# EAGLE design M0_Express_ekho_shield (EAGLE 9.1.3)
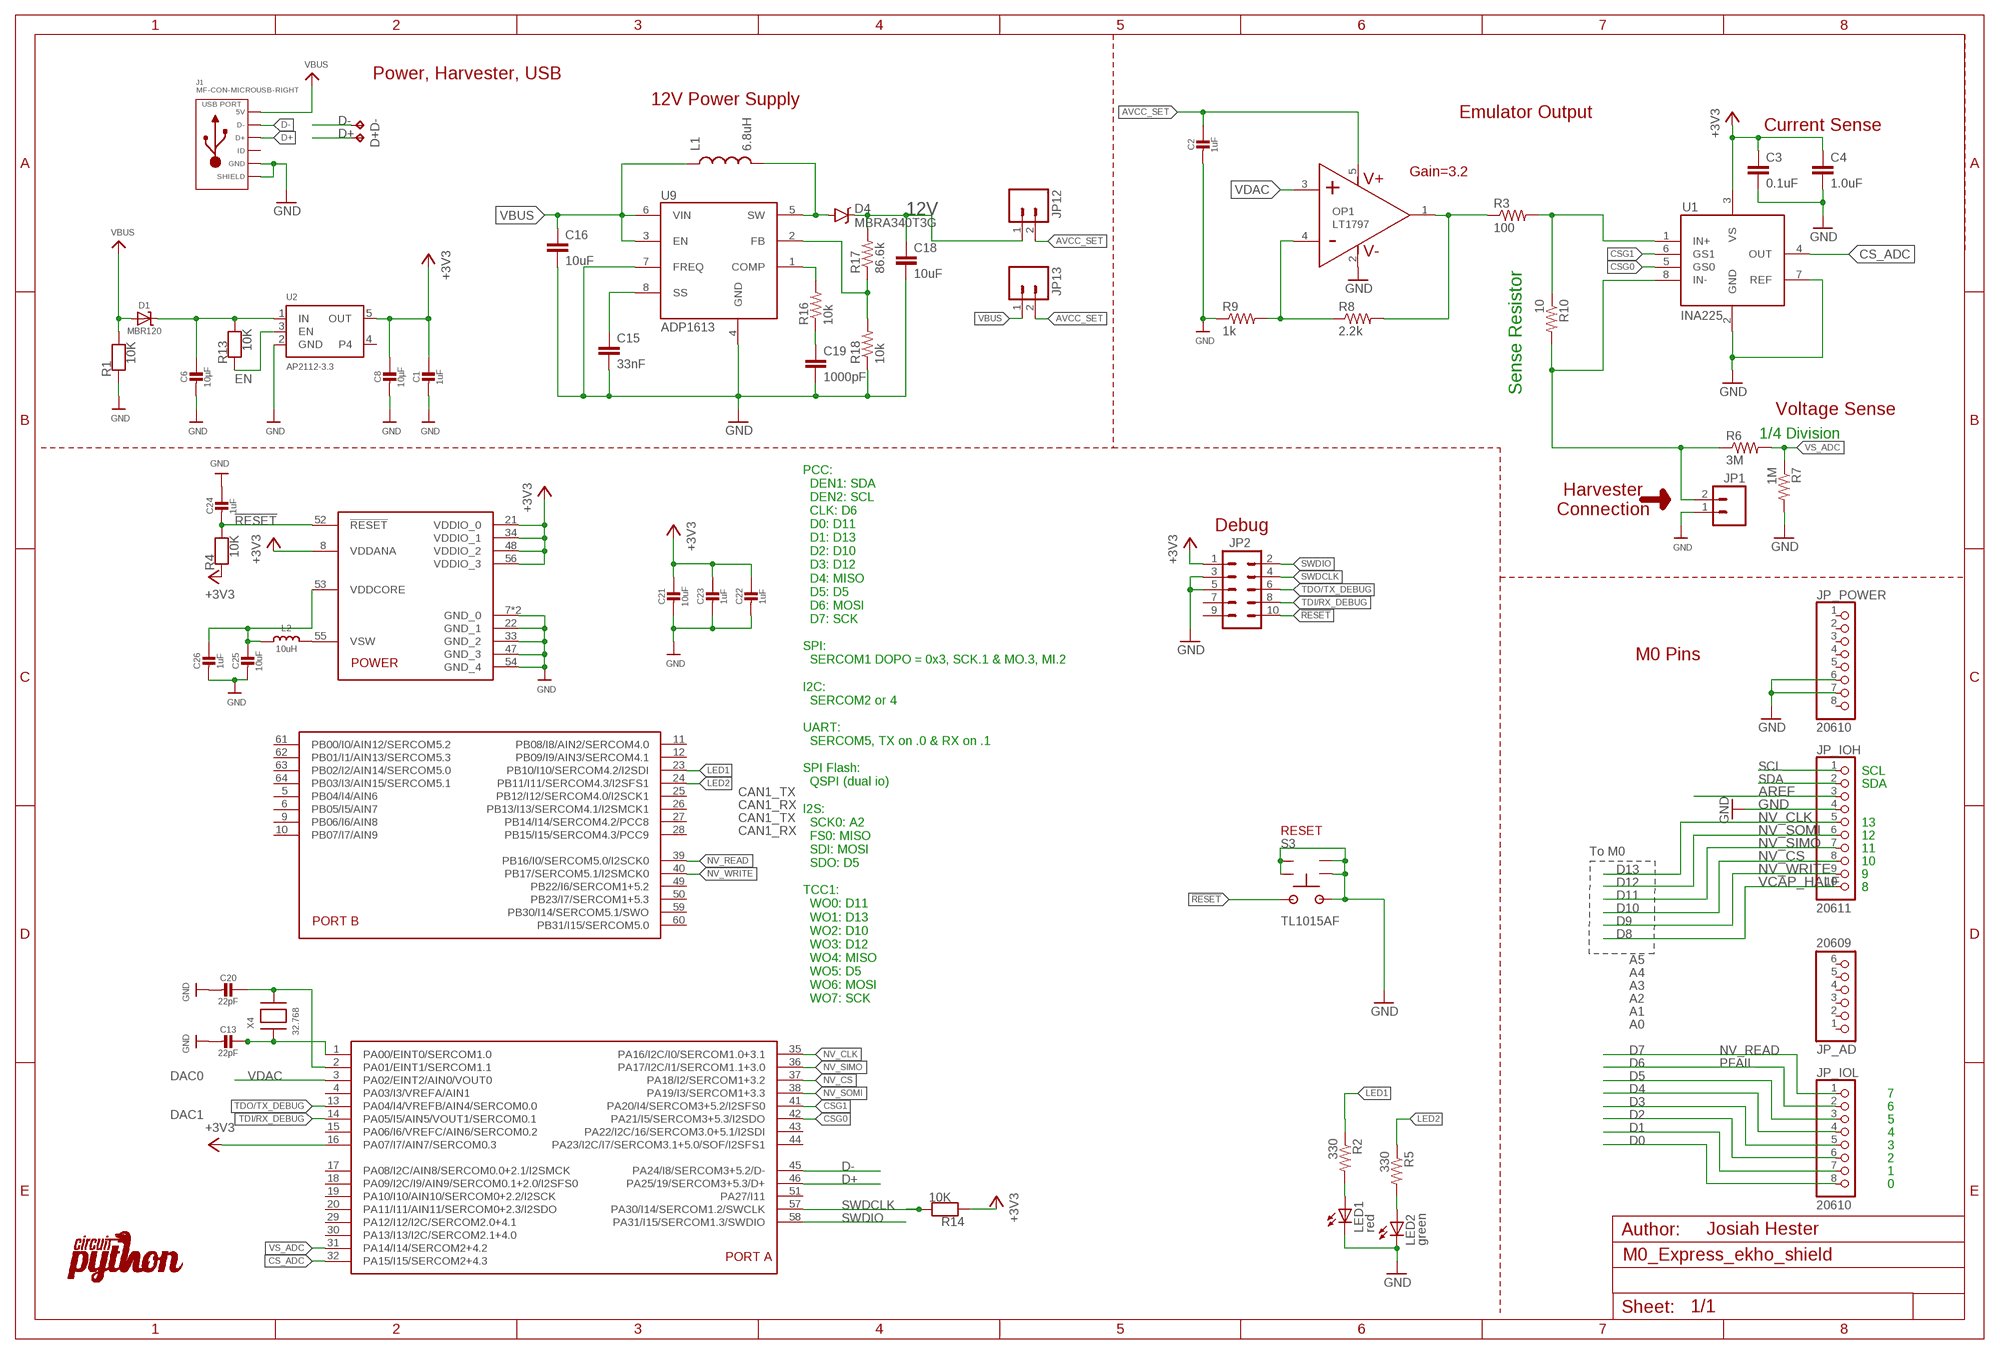
[diagram p0: schematic, sheet 1]

## Parts
C1  1uF  CAP_CERAMIC0603_NO  [0603-NO]
C2  1uF  CAP_CERAMIC0603_NO  [0603-NO]
C3  0.1uF  C-EU0603  [0603]
C4  1.0uF  C-EU0603  [0603]
C6  10µF  CAP_CERAMIC0805-NOOUTLINE  [0805-NO]
C8  10µF  CAP_CERAMIC0805-NOOUTLINE  [0805-NO]
C13  22pF  CAP_CERAMIC0603_NO  [0603-NO]
C15  33nF  CAP0805  [0805]
C16  10uF  CAP0805  [0805]
C18  10uF  CAP1206  [1206]
C19  1000pF  CAP0805  [0805]
C20  22pF  CAP_CERAMIC0603_NO  [0603-NO]
C21  10uF  CAP_CERAMIC0805-NOOUTLINE  [0805-NO]
C22  1uF  CAP_CERAMIC0603_NO  [0603-NO]
C23  1uF  CAP_CERAMIC0603_NO  [0603-NO]
C24  1uF  CAP_CERAMIC0603_NO  [0603-NO]
C25  10uF  CAP_CERAMIC0805-NOOUTLINE  [0805-NO]
C26  1uF  CAP_CERAMIC0603_NO  [0603-NO]
D1  MBR120  DIODE-SCHOTTKYSOD-123  [SOD-123]
D4  MBRA340T3G  [SMA]
D+  TPB1,27  [B1,27]
D-  TPB1,27  [B1,27]
J1  MF-CON-MICROUSB-RIGHT  USB_MICRO_RIGHT  [MICROUSB-RIGHT]
JP1  M02LOCK  [1X02_LOCK]
JP2  M05X21.27MM  [2X5_1.27MM]
JP12  M02LOCK  [1X02_LOCK]
JP13  M02LOCK  [1X02_LOCK]
JP_AD  20609  HEADER-1X6OVALWAVE  [1X06_OVALWAVE]
JP_IOH  20611  HEADER-1X10OVALWAVE  [1X10_OVALWAVE]
JP_IOL  20610  HEADER-1X8OVALWAVE  [1X08_OVALWAVE]
JP_POWER  20610  HEADER-1X8OVALWAVE  [1X08_OVALWAVE]
L1  6.8uH  D03316P  [D03316P]
L2  10uH  INDUCTOR  [INDUCTOR_1007]
LED1  red  LED0603  [LED-0603]
LED2  green  LED0603  [LED-0603]
OP1  LT1797  [TSOT23-8]
R1  10K  RESISTOR_0603_NOOUT  [0603-NO]
R2  330  R-EU0603  [0603]
R3  100  RESISTOR0805-RES  [0805]
R4  10K  RESISTOR_0603_NOOUT  [0603-NO]
R5  330  R-EU0603  [0603]
R6  3M  R-EU0603  [0603]
R7  1M  R-EU0603  [0603]
R8  2.2k  R-EU0603  [0603]
R9  1k  R-EU0603  [0603]
R10  10  RESISTOR0805-RES  [0805]
R13  10K  RESISTOR_0603_NOOUT  [0603-NO]
R14  10K  RESISTOR_0603_NOOUT  [0603-NO]
R16  10k  RESISTOR0805-RES  [0805]
R17  86.6k  R-EU0603  [0603]
R18  10k  R-EU0603  [0603]
S3  TL1015AF  [TS1015]
U1  INA225  [MSOP8]
U2  AP2112-3.3  VREG_SOT23-5  [SOT23-5]
U9  ADP1613  [MSOP08]
U$1  LOGO  [CIRCUITPYTHON-LOGO]
U$14  ATSAMD51J  [PQFN64-1]
X4  32.768  XTAL-3.2X1.5  [XTAL3215]

## Nets
12V: C18.1 D4.C JP12.1 R17.2
!RESET: C24.2 JP2.10 R4.2 S3.2 U$14.52(!RESET)
+3V3 [USB]: C1.1 C3.1 C4.1 C8.1 C21.1 C22.1 C23.1 JP2.1 R4.1 R14.1 U1.3(VS) U2.5(OUT) U$14.8(VDDANA) U$14.16(PA07/I7/AIN7/SERCOM0.3) U$14.21(VDDIO_0) U$14.34(VDDIO_1) U$14.48(VDDIO_2) U$14.56(VDDIO_3)
AREF [aref]: JP_IOH.3
AVCC_SET: C2.1 JP12.2 JP13.2 OP1.5(V+)
CS_ADC: U1.4(OUT) U$14.32(PA15/I15/SERCOM2+4.3)
CSG0: U1.5(GS0) U$14.42(PA21/I5/SERCOM3+5.3/I2SDO)
CSG1: U1.6(GS1) U$14.41(PA20/I4/SERCOM3+5.2/I2SFS0)
D0: JP_IOL.8
D1: JP_IOL.7
D2: JP_IOL.6
D3: JP_IOL.5
D4: JP_IOL.4
D5: JP_IOL.3
D+: D+.TP J1.3(D+) U$14.46(PA25/19/SERCOM3+5.3/D+)
D-: D-.TP J1.2(D-) U$14.45(PA24/I8/SERCOM3+5.2/D-)
EN: R13.1 U2.3(EN)
GND [gnd]: C1.2 C2.2 C3.2 C4.2 C6.2 C8.2 C13.2 C15.2 C16.2 C18.2 C19.2 C20.2 C21.2 C22.2 C23.2 C24.1 C25.2 C26.2 J1.5(GND) J1.S1(SLD) J1.S2(SLD) J1.S3(SLD) J1.S4(SLD) J1.S5(SLD) J1.S6(SLD) JP1.1 JP2.3 JP2.5 JP_IOH.4 JP_POWER.6 JP_POWER.7 LED1.C LED2.C OP1.2(V-) R1.1 R7.2 R9.1 R18.1 S3.1 S3.G1(GND) S3.G2(GND) S3.G3(GND) S3.G4(GND) U1.2(GND) U1.7(REF) U2.2(GND) U9.4(GND) U9.7(FREQ) U$14.7(GND_0) U$14.22(GND_1) U$14.33(GND_2) U$14.47(GND_3) U$14.54(GND_4) U$14.EXP(GND_0)
HARVESTER_IN: OP1.1(OUT) R3.1 R8.2
HIGH_LOAD_V+: R3.2 R10.1 U1.1(IN+)
LED1: R2.1 U$14.23(PB10/I10/SERCOM4.2/I2SDI)
LED2: R5.1 U$14.24(PB11/I11/SERCOM4.3/I2SFS1)
LOW_LOAD_V+: JP1.2 R6.1 R10.2 U1.8(IN-)
N$5: OP1.4(IN-) R8.1 R9.2
N$7: C13.1 U$14.1(PA00/EINT0/SERCOM1.0) X4.P$1
N$8: C20.1 U$14.2(PA01/EINT1/SERCOM1.1) X4.P$2
N$9: C15.1 U9.8(SS)
N$10: L2.P$2 U$14.55(VSW)
N$11: R16.2 U9.1(COMP)
N$12: C19.1 R16.1
N$13: R17.1 R18.2 U9.2(FB)
N$14: LED1.A R2.2
N$15: LED2.A R5.2
NV_CLK: JP_IOH.5 U$14.35(PA16/I2C/I0/SERCOM1.0+3.1)
NV_CS: JP_IOH.8 U$14.37(PA18/I2/SERCOM1+3.2)
NV_READ: JP_IOL.1 U$14.39(PB16/I0/SERCOM5.0/I2SCK0)
NV_SIMO: JP_IOH.7 U$14.36(PA17/I2C/I1/SERCOM1.1+3.0)
NV_SOMI: JP_IOH.6 U$14.38(PA19/I3/SERCOM1+3.3)
NV_WRITE: JP_IOH.9 U$14.40(PB17/SERCOM5.1/I2SMCK0)
PFAIL: JP_IOL.2
SCL: JP_IOH.1
SDA: JP_IOH.2
SW: D4.A L1.P$2 U9.5(SW)
SWDCLK: JP2.4 R14.2 U$14.57(PA30/I14/SERCOM1.2/SWCLK)
SWDIO: JP2.2 U$14.58(PA31/I15/SERCOM1.3/SWDIO)
TDI/RX_DEBUG: JP2.8 U$14.14(PA05/I5/AIN5/VOUT1/SERCOM0.1)
TDO/TX_DEBUG: JP2.6 U$14.13(PA04/I4/VREFB/AIN4/SERCOM0.0)
VBUS [USB]: C16.1 D1.A J1.1(5V) JP13.1 L1.P$1 R1.2 U9.3(EN) U9.6(VIN)
VCAP_HALF: JP_IOH.10
VDAC: OP1.3(IN+) U$14.3(PA02/EINT2/AIN0/VOUT0)
VDDCORE1: C25.1 C26.1 L2.P$1 U$14.53(VDDCORE)
VHI: C6.1 D1.C R13.2 U2.1(IN)
VS_ADC: R6.2 R7.1 U$14.31(PA14/I14/SERCOM2+4.2)
Unconnected: J1.4(ID) JP2.7 JP2.9 JP_AD.1 JP_AD.2 JP_AD.3 JP_AD.4 JP_AD.5 JP_AD.6 JP_POWER.1 JP_POWER.2 JP_POWER.3 JP_POWER.4 JP_POWER.5 JP_POWER.8 U2.4 U$14.4(PA03/I3/VREFA/AIN1) U$14.5(PB04/I4/AIN6) U$14.6(PB05/I5/AIN7) U$14.9(PB06/I6/AIN8) U$14.10(PB07/I7/AIN9) U$14.11(PB08/I8/AIN2/SERCOM4.0) U$14.12(PB09/I9/AIN3/SERCOM4.1) U$14.15(PA06/I6/VREFC/AIN6/SERCOM0.2) U$14.17(PA08/I2C/AIN8/SERCOM0.0+2.1/I2SMCK) U$14.18(PA09/I2C/I9/AIN9/SERCOM0.1+2.0/I2SFS0) U$14.19(PA10/I10/AIN10/SERCOM0+2.2/I2SCK) U$14.20(PA11/I11/AIN11/SERCOM0+2.3/I2SDO) U$14.25(PB12/I12/SERCOM4.0/I2SCK1) U$14.26(PB13/I13/SERCOM4.1/I2SMCK1) U$14.27(PB14/I14/SERCOM4.2/PCC8) U$14.28(PB15/I15/SERCOM4.3/PCC9) U$14.29(PA12/I12/I2C/SERCOM2.0+4.1) U$14.30(PA13/I13/I2C/SERCOM2.1+4.0) U$14.43(PA22/I2C/16/SERCOM3.0+5.1/I2SDI) U$14.44(PA23/I2C/I7/SERCOM3.1+5.0/SOF/I2SFS1) U$14.49(PB22/I6/SERCOM1+5.2) U$14.50(PB23/I7/SERCOM1+5.3) U$14.51(PA27/I11) U$14.59(PB30/I14/SERCOM5.1/SWO) U$14.60(PB31/I15/SERCOM5.0) U$14.61(PB00/I0/AIN12/SERCOM5.2) U$14.62(PB01/I1/AIN13/SERCOM5.3) U$14.63(PB02/I2/AIN14/SERCOM5.0) U$14.64(PB03/I3/AIN15/SERCOM5.1)

## Notes on the sheet
- Power, Harvester, USB
- 12V Power Supply
- Emulator Output
- Current Sense
- Gain=3.2
- Sense Resistor
- Voltage Sense
- 1/4 Division
- Harvester
  Connection
- Debug
- M0 Pins
- SCL
- SDA
- CAN1_TX
- CAN1_RX
- CAN1_TX | 13
- CAN1_RX | RESET | 12
- 11
- To M0
- 10
- D13 | 9
- D12 | 8
- D11
- D10
- D9
- D8
- A5
- A4
- A3
- PCC:
    DEN1: SDA
    DEN2: SCL
    CLK: D6
    D0: D11
    D1: D13
    D2: D10
    D3: D12
    D4: MISO
    D5: D5
    D6: MOSI
    D7: SCK
  
  SPI:
    SERCOM1 DOPO = 0x3, SCK.1 & MO.3, MI.2
  
  I2C:
    SERCOM2 or 4
  
  UART:
    SERCOM5, TX on .0 & RX on .1
  
  SPI Flash:
    QSPI (dual io)
  
  I2S:
    SCK0: A2
    FS0: MISO
    SDI: MOSI
    SDO: D5
  
  TCC1:
    WO0: D11
    WO1: D13
    WO2: D10
    WO3: D12
    WO4: MISO
    WO5: D5
    WO6: MOSI
    WO7: SCK
- A2
- A1
- A0
- D7
- D6
- DAC0
- 7
- 6
- DAC1 | 5
- 4
- 3
- 2
- 1
- 0
- Josiah Hester

## Library data of the parts
C1 C2 C6 C8 C13 C20-C26 = microbuilder:CAP_CERAMIC: Ceramic Capacitors For new designs, use the packages preceded by an '_' character since they are more reliable: The following footprints should be used on most boards: _0402 - Standard footprint for regular board layouts _0603 - Standard footprint for regular board layouts _0805 - Standard footprint for regular board layouts _1206 - Standard footprint for regular board layouts For extremely tight-pitch boards where space is at a premium, the following 'micro-pitch' footprints can be used (smaller pads, no silkscreen outline, etc.): _0402MP - Micro-pitch footprint for very dense/compact boards _0603MP - Micro-pitch footprint for very dense/compact boards _0805MP - Micro-pitch footprint for very dense/compact boards _1206MP - Micro-pitch footprint for very dense/compact boards
C3 = tiny_passives:C-EU; DIGIKEY: 490-3271-1-ND
C4 = tiny_passives:C-EU; DIGIKEY: 490-3890-1-ND
C15 = SparkFun-Capacitors:CAP: Capacitor Standard 0603 ceramic capacitor, and 0.1" leaded capacitor.; DIGIKEY: 399-8070-1-ND; MPN: C0805C333J5RACTU
C16 = SparkFun-Capacitors:CAP: Capacitor Standard 0603 ceramic capacitor, and 0.1" leaded capacitor.; DIGIKEY: 587-1295-1-ND; MPN: EMK212BJ106KG-T
C18 = SparkFun-Capacitors:CAP: Capacitor Standard 0603 ceramic capacitor, and 0.1" leaded capacitor.; DIGIKEY: 587-1337-1-ND; MPN: TMK316BJ106KL-T
C19 = SparkFun-Capacitors:CAP: Capacitor Standard 0603 ceramic capacitor, and 0.1" leaded capacitor.; DIGIKEY: 399-1149-1-ND
D1 = microbuilder:DIODE-SCHOTTKY
D4 = MBRA340T3G:MBRA340T3G: Surface Mount Schottky Power Rectifier: 3.0 AMPERES 40 VOLTS, SMA Power Surface Mount Package Employing the Schottky Barrier principle in a large area metal−to−silicon power diode. State of the art geometry features epitaxial construction with oxide passivation and metal overlay contact. Ideally suited for low voltage, high frequency rectification, or as free wheeling and polarity diodes in surface mount applications where compact size and weight are critical to the system.; DIGIKEY: MBRA340T3GOSCT-ND; MPN: MBRA340T3G
D+ D- = testpad:TP: Test pad
J1 = MF_Connectors:USB: Library: MF_Connectors Description: 5 Pin USB Connectors. SLD is the shield connection. Usually tied to ground through a small ferrite bead.; HOUSEPART: YES; MPN: MF-CON-MICROUSB-RIGHT; POPULATE: 1; URL: https://factory.macrofab.com/part/MF-CON-MICROUSB-RIGHT
JP1 JP12 JP13 = SparkFun-Connectors:M02: Standard 2-pin 0.1" header. Use with - straight break away headers ( PRT-00116) - right angle break away headers (PRT-00553) - swiss pins (PRT-00743) - machine pins (PRT-00117) - female headers (PRT-00115) Molex polarized connector foot print use with: PRT-08233 with associated crimp pins and housings. 2.54_SCREWTERM for use with PRT-10571. 3.5mm Screw Terminal footprints for PRT-08084 5mm Screw Terminal footprints for use with PRT-08432
JP2 = SparkFun-Connectors:M05X2: Header 5x2 Standard 10-pin dual row 0.1" header. Commonly used with AVR-ISP. Use with Spark Fun Electronics SKU: PRT-00778; DIGIKEY: 1175-1627-ND; MPN: 3220-10-0100-00
JP_AD = microbuilder:HEADER-1X6: PIN HEADER
JP_IOH = microbuilder:HEADER-1X10: PIN HEADER
JP_IOL JP_POWER = microbuilder:HEADER-1X8: PIN HEADER
L1 = do3316p:D03316P; MPN: DO3316P
L2 = microbuilder:INDUCTOR: Inductors 0603: 10nH Ceramic Inductor - microwire antenna/RF (Digikey: 712-1434-2-ND) 0805: 560nH Ceramic Inductor - RF (Digikey: 553-1047-1-ND) 270nH Ceramic Inductor - Q = 40@250MHz, +-5%, 1 Ohm DC Resistance (Digikey: 535-10506-2-ND) 1007 (2518 Metric) SMT: 10µH 10% 250mOhm 820mA 1007 Inductor (Digikey: 587-2189-1-ND) 22µH 10% 500mOhm 580mA 1007 Inductor (Digikey: 587-2190-1-ND) 47µH 10% 950mOhm 420mA 1007 Inductor (Digikey: 587-2191-1-ND) 47µH 5% 100mOhm 1A 1008 Inductor (Digikey: 732-1816-1-ND) 5.0x5.0mm (Taiyo Yuden NR5040 Series) 6.8µH 20% 2.3A 64mOhm Inductor (Digikey: 587-2374-2-ND) 5.0x5.0mm (TDK VLC5045 Series) 4.7µH 20% 3.3A 34mOhm Inductor (Digikey: 445-6526-1-ND) 6.8µH 20% 2.7A 46mOhm Inductor (Digikey: 445-6527-1-ND) 6.0x6.0mm (TDK VLC6045 Series) 4.7µH 20% 3.8A 27mOhm Inductor (Digikey: 445-6538-2-ND) 6.8µH 20% 3A 41mOhm Inductor (Digikey: 445-6540-1-ND) 6.2µH 30% 2.2A 45mOhm Inductor (Digikey: SRR5028-6R2YCT-ND) - Not TDK VLC6045 but footprint should match 6.0x6.0mm (TDK SLF6045 Series) 6.8uH 30% 2A 33mOhm Inductor (Digikey: 445-4572-1-ND, Mouser: 810-SLF645T6R8N2R0PF) 6.0x6.0mm (Sumida CDRH5D28 Series) 6.2uH 30% 1.8A 45mOhm Inductor (Digikey: 308-1542-1-ND) Taiyo Yuden NR3015T2R2M - 2.2uH 20% 1.5A (Digikey: 587-1648-2-ND, Mouser: 963-NR3015T2R2M) - Used with TI TPS62172 CoilCraft RFID Transponder Coil - MA5532-AE (For use with AS3935 Lightning Sensor) Taiyo Yuden NRH2412T2R2MNGH - 2.2uH 20% 1AA (Digikey: 587-3443-1-ND) - Used with TI LM3671 Vishay IHLP 1.0uH Molded Inductor - 24mOhm DCR, 5A, +/-20%, -55°C-125°C (Digikey: 541-1319-1-ND)
LED1 LED2 = SparkFun-LED:LED: LEDs Standard schematic elements and footprints for 5mm, 3mm, 1206, and 0603 sized LEDs. 5mm - Spark Fun Electronics SKU : COM-00529 (and others)
OP1 = LT1797:LT1797: LT1797: 10MHz, Rail-to-Rail Input and Output Op Amp in SOT-23 The LT®1797 is a unity-gain stable 10MHz op amp available in the small SOT-23 package that operates on all single and split supplies with a total voltage of 2.7V to 12V. The amplifier draws 1mA of quiescent current and has a slew rate of 2.25V/μs. The input common mode range of the LT1797 includes both rails, making it ideal for current sensing applications. The input stage incorporates phase reversal protection to prevent false outputs from occurring when the inputs are driven beyond the supplies. Protective resistors are included in the input leads so that current does not become excessive when the inputs are forced above or below the supplies. The output of the LT1797 can swing to within 50mV of V+ and 8mV of V– without drawing excess current in either condition. The amplifier can drive loads up to 25mA and still maintain rail-to-rail capability.; DIGIKEY: LT1797CS5#TRMPBFTR-ND
R1 R4 R13 R14 = microbuilder:RESISTOR: Resistors For new designs, use the packages preceded by an '_' character since they are more reliable: The following footprints should be used on most boards: _0402 - Standard footprint for regular board layouts _0603 - Standard footprint for regular board layouts _0805 - Standard footprint for regular board layouts _1206 - Standard footprint for regular board layouts For extremely tight-pitch boards where space is at a premium, the following 'micro-pitch' footprints can be used (smaller pads, no silkscreen outline, etc.): _0402MP - Micro-pitch footprint for very dense/compact boards _0603MP - Micro-pitch footprint for very dense/compact boards _0805MP - Micro-pitch footprint for very dense/compact boards _1206MP - Micro-pitch footprint for very dense/compact boards
R2 R5 = tiny_passives:R-EU
R3 R10 = SparkFun-Passives:RESISTOR: Resistor Basic schematic elements and footprints for 0603, 1206, and PTH resistors.
R6 R7 = tiny_passives:R-EU; DIGIKEY: P2.0MJCT-ND
R8 R9 = tiny_passives:R-EU; DIGIKEY: 311-40.2KLRCT-ND
R16 = SparkFun-Passives:RESISTOR: Resistor Basic schematic elements and footprints for 0603, 1206, and PTH resistors.; DIGIKEY: 311-10KARCT-ND; MPN: RC0805JR-0710KL
R17 = tiny_passives:R-EU; DIGIKEY: 311-86.6KCRCT-ND; MPN: RC0805FR-0786K6L
R18 = tiny_passives:R-EU; DIGIKEY: 541-10.0KCCT-ND; MPN: CRCW080510K0FKEA
S3 = eswitch:TL1015AF; MPN: TL1015AF160QG
U1 = ina225:INA225; DIGIKEY: 296-37540-1-ND; MPN: INA225AIDGKT
U2 = microbuilder:VREG_SOT23-5: SOT23-5 Fixed Voltage Regulators Part Current Out V Out V In V Dropout θJA (°C/W) TJ (°C) Digikey Part No. ADP121 150mA 3.3V 3.4-5.5V 0.09V @ 150mA -- -- ADP121-AUJZ33R7CT-ND ADP121 150mA 3.0V 3.1-5.5V 0.09V @ 150mA -- -- ADP121-AUJZ30R7CT-ND ADP122 300mA 3.3V 3.4-5.5V 0.085V @ 300mA -- -- ADP122AUJZ-3.3-R7CT-ND ADP1712 300mA 3.3V 3.5-5.5V 0.17V @ 300mA -- -- ADP1712AUJZ-3.3-R7TR-ND AP7311 (Low Cost) 150mA 3.3V 3.5-6V 0.15V @ 150mA -- -- AP7311-33WG-7DICT-ND LD39015M18R 150mA 1.8V 1.9V-5.5V 0.08V @ 100mA -- -- 497-6977-1-ND LP2985A-33DBVR 150mA 3.3V 3.3-16V 0.28V @ 150mA 206 150 296-18479-1-ND MCP1824T-3302E/OT 300mA 3.3V 3.5V-6V 0.2V @ 300mA -- -- MCP1824T-3302E/OTCT-ND MIC5205-2.5YM5 TR 150mA 2.5V 2.7-16V 0.165V @ 150mA -- -- 576-1257-2-ND MIC5205-3.0YM5 TR 150mA 3.0V 3.2V-16V 0.165V @ 150mA -- -- 576-1258-2-ND MIC5205-3.3YM5 TR 150mA 3.3V 3.5V-16V 0.165V @ 150mA -- -- 576-1259-2-ND TPS780330220 150mA 3.3V+2.2V 3.6-5.5V 250mV Max -- -- 296-23332-1-ND TDA3663/N1,135 100mA 3.3V 3.5-45V 0.18V @ 50mA -- -- 568-5343-1-ND Max operating temp can be calculated using θJA, TJ (max junction temperature), and power in watts. Set the "Maximum Ambient Temperature" until it reaches TJ ("Max Junction Temperature"), which is the absolute limit for safe use of the regulator: Heat Sink Temperature Calculator <http://www.daycounter.com/Calculators/Heat-Sink-Temperature-Calculator.phtml> For example, With 12V source into a 3.3V LP2985 and a 30mA load, we are dissipating (12V-3.3V) * 0.03A = 0.261W. With a θJA of 206 °C/W, a TJ of 150°C, and 261mW we can safely use the chip without a heat sink up to 75°C (=147.1°C Junction Temperature).
U9 = ADP1613:ADP1613: 650 kHz /1.3 MHz Step-Up PWM DC-to-DC Switching Converters The ADP1612/ADP1613 are step-up dc-to-dc switching converters with an integrated power switch capable of providing an output voltage as high as 20 V. With a package height of less than 1.1 mm, the ADP1612/ADP1613 are optimal for spaceconstrained applications such as portable devices or thin film transistor (TFT) liquid crystal displays (LCDs). The ADP1612/ADP1613 operate in current mode pulse-width modulation (PWM) with up to 94% efficiency. Adjustable soft start prevents inrush currents when the part is enabled. The pin-selectable switching frequency and PWM current-mode architecture allow for excellent transient response, easy noise filtering, and the use of small, cost-saving external inductors and capacitors. Other key features include undervoltage lockout (UVLO), thermal shutdown (TSD), and logic controlled enable.; DIGIKEY: ADP1613ARMZ-R7CT-ND; MPN: ADP1613ARMZ-R7
U$1 = circuitpython-logo:LOGO
U$14 = microbuilder:ATSAMD51J: ATSAMD51J cortex m4 microcontroller; DIGIKEY: ATSAMD51J19A-MU-ND; MPN: ATSAMD51J19A-MU
X4 = adafruit2:XTAL: Low cost SMT crystals, no capacitors included http://www.ladyada.net/library/eagle

## Net classes
0 default: width 0.152 mm, drill 0.152 mm, clearance 0.152 mm

## Board
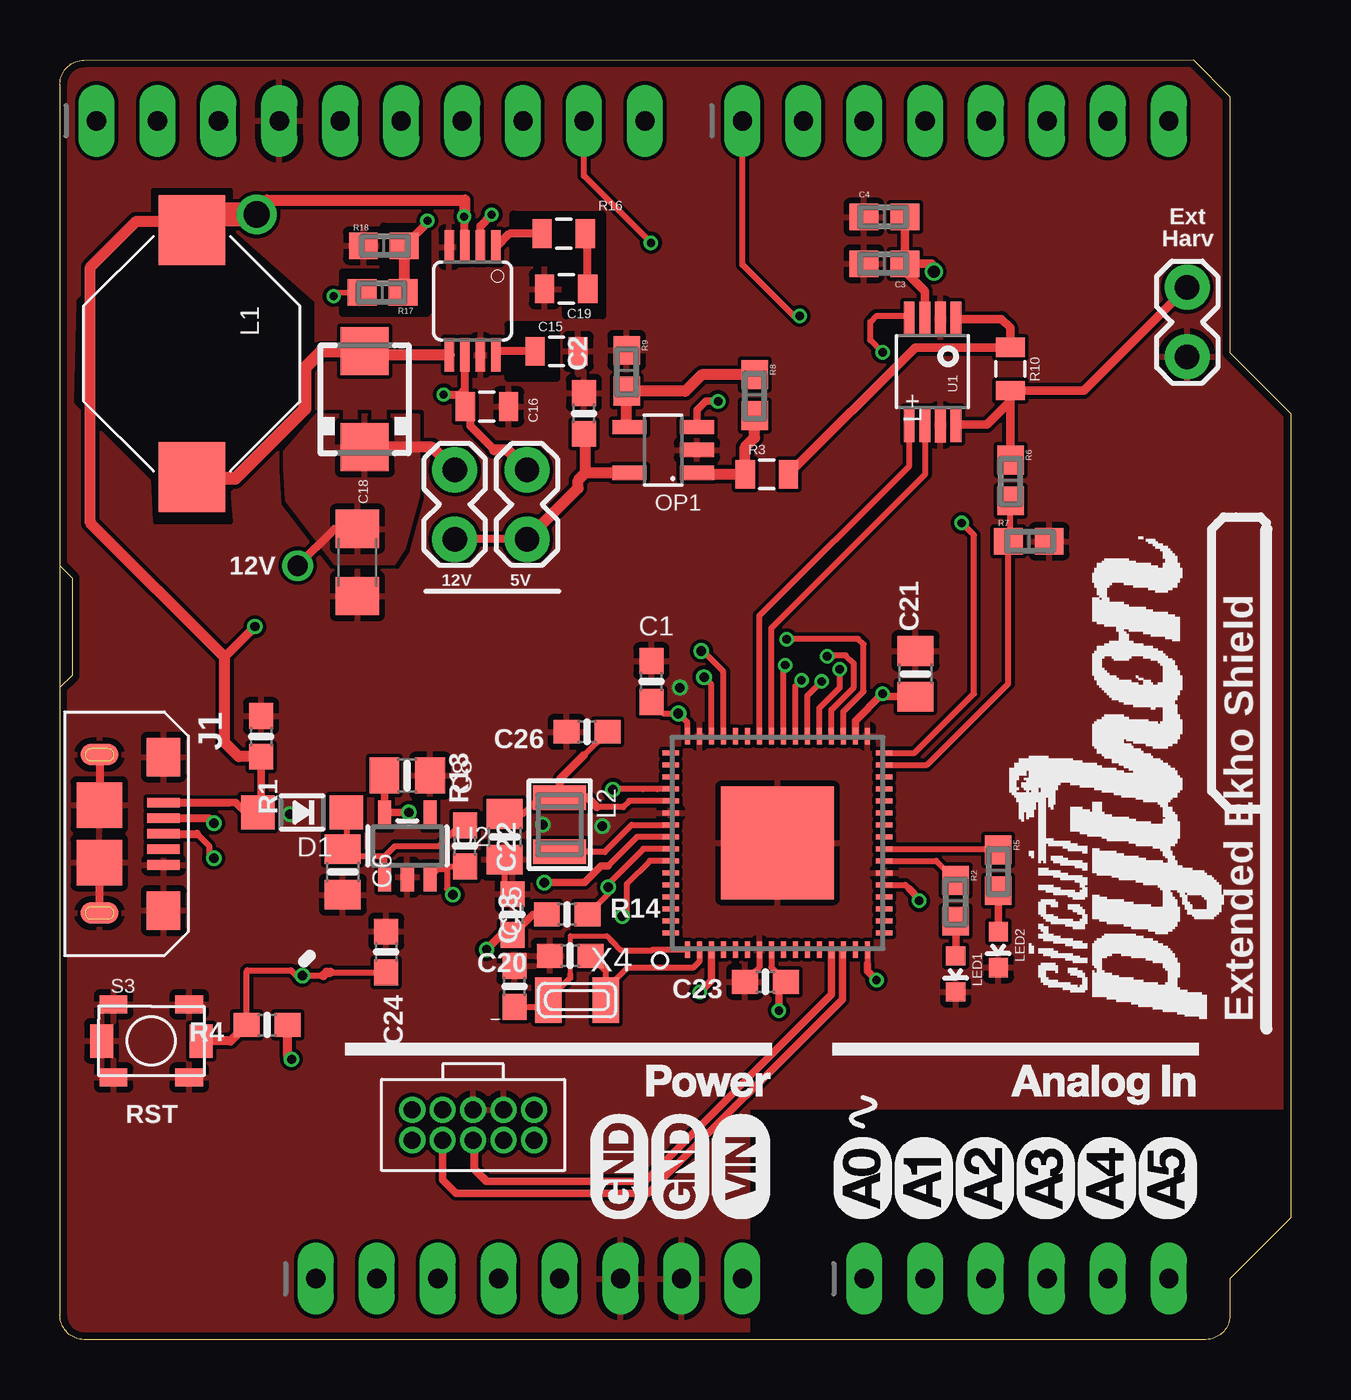
[diagram p1: board, top side]
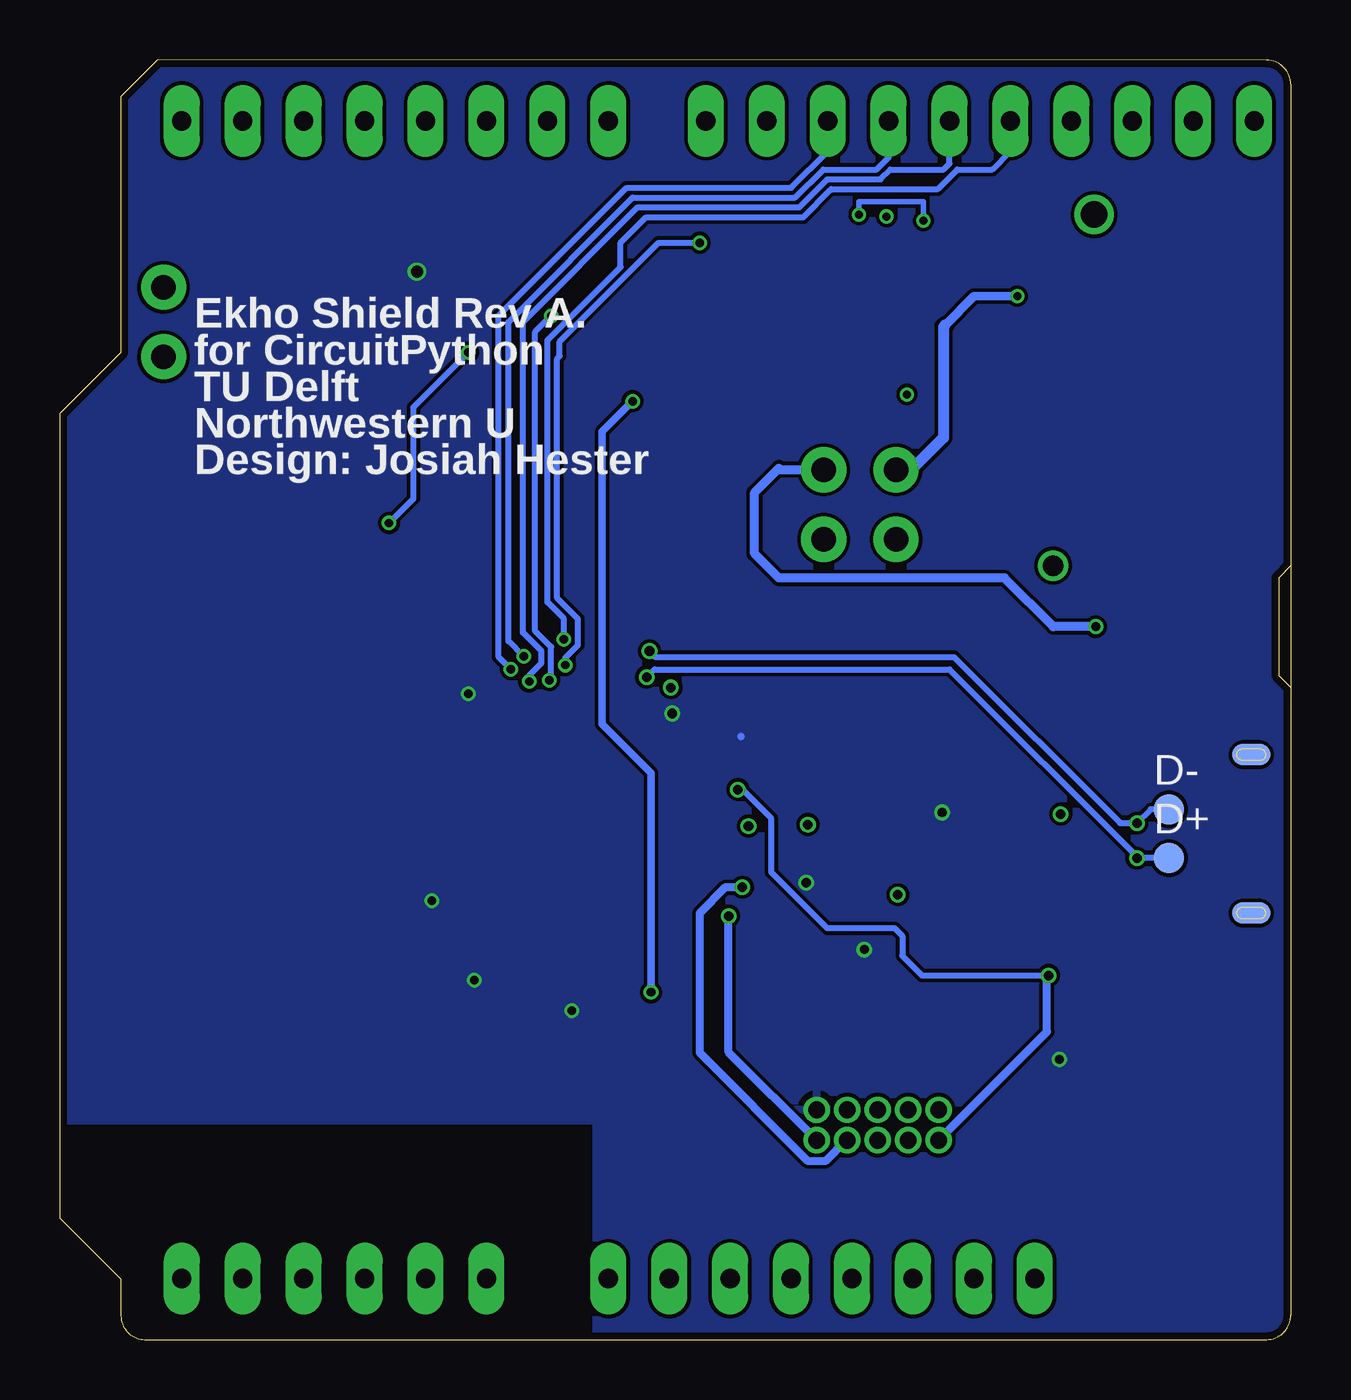
[diagram p2: board, bottom side, seen from below]

Size 51.31 x 53.34 mm. Coordinates in mm from the lower left corner, seen from the top.
Outline: 51.31,13.72 51.31,5.08 48.77,2.54 48.77,1 arc-90 47.77,0 1,0 arc-90 0,1.02 0,52.32 arc-90 1,53.32 47.24,53.34 48.77,51.82 48.77,41.15 51.31,38.61 51.31,24.38 51.31,13.72
Outline: 51.31,13.97 51.31,13.72
Outline: 0,32.26 0.51,31.75 0.51,27.69 0,27.18
Copper layers (1*16): Top 0.035559375mm / dielectric 1.6mm / Bottom 0.035559375mm
Design rules "oshpark-2layer *": minimum track width 6mil, minimum drill 10mil, track to track 6mil, track to pad 6mil, pad to pad 6mil, via to via 6mil, smd to smd 6mil, copper to edge 12mil, drill to drill 6mil, minimum pad ring 5mil, minimum via ring 5mil, stop-mask expansion 2.5mil, vias tented up to drill 0mil, thermal gap 10mil

### Footprints (pad centres in the part's own frame; a part is rotated, then mirrored left to right if it is on the bottom)
0603-NO = smd 1.075 x 1: 1 -0.85,0; 2 0.85,0
0603 = smd 1.2 x 1.1: 1 -0.85,0; 2 0.85,0
0805-NO = smd 1.24 x 1.5: 1 -0.95,0; 2 0.95,0
0805 = smd 0.8 x 1.2: 1 -0.9,0; 2 0.9,0
1206 = smd 1.6 x 1.8: 1 -1.4,0; 2 1.4,0
SOD-123 = smd 1.4 x 1.4: A 1.85,0; C -1.85,0
SMA = smd 2 x 2: A 2,0; C -2,0
B1,27 = smd 1.27 x 1.27: TP 0,0
MICROUSB-RIGHT = smd 0.4 x 1.35: 1 -1.3,1.27; 2 -0.65,1.27; 3 0,1.27; 4 0.65,1.27; 5 1.3,1.27 | smd 0.9 x 1.6: S1 -3.3,-1.4; S2 3.3,-1.4 | smd 1.6 x 1.4: S3 -3.2,1.27; S4 3.2,1.27 | smd 1.9 x 1.9: S5 -1.2,-1.405; S6 1.2,-1.405 | smd 0.9 x 1.6 bottom: S7 -3.3,-1.4; S8 3.3,-1.4
1X02_LOCK = drill 1.016 pad 1.88: 1 -0.178,0; 2 2.718,0
2X5_1.27MM = drill 0.7 pad 1.1: 1 0,0; 2 1.27,0; 3 0,-1.27; 4 1.27,-1.27; 5 0,-2.54; 6 1.27,-2.54; 7 0,-3.81; 8 1.27,-3.81; 9 0,-5.08; 10 1.27,-5.08
1X06_OVALWAVE = drill 0.8 pad 1.5 long: 1 -6.35,0; 2 -3.81,0; 3 -1.27,0; 4 1.27,0; 5 3.81,0; 6 6.35,0
1X10_OVALWAVE = drill 0.8 pad 1.5 long: 1 -11.43,0; 2 -8.89,0; 3 -6.35,0; 4 -3.81,0; 5 -1.27,0; 6 1.27,0; 7 3.81,0; 8 6.35,0; 9 8.89,0; 10 11.43,0
1X08_OVALWAVE = drill 0.8 pad 1.5 long: 1 -8.89,0; 2 -6.35,0; 3 -3.81,0; 4 -1.27,0; 5 1.27,0; 6 3.81,0; 7 6.35,0; 8 8.89,0
D03316P = smd 2.92 x 2.79: P$1 -5.145,0; P$2 5.145,0
INDUCTOR_1007 = smd 1.016 x 2.2: P$1 -1.127,0; P$2 1.127,0
LED-0603 = smd 0.8 x 0.8: A 0,-0.75; C 0,0.75
TSOT23-8 = smd 0.6 x 1.42: 1 -0.95,-1.41; 2 0,-1.41; 3 0.95,-1.41; 4 0.95,1.41; 5 -0.95,1.41
TS1015 = smd 0.95 x 1.4: 1 -2.075,0; 2 2.075,0 | smd 1.15 x 0.75: G1 -1.575,1.525; G2 1.575,1.525; G3 -1.575,-1.525; G4 1.575,-1.525
MSOP8 = smd 0.45 x 1.45: 1 -0.975,-2.2; 2 -0.325,-2.2; 3 0.325,-2.2; 4 0.975,-2.2; 5 0.975,2.2; 6 0.325,2.2; 7 -0.325,2.22; 8 -0.975,2.2
SOT23-5 = smd 0.55 x 1.2: 1 -0.95,-1.3; 2 0,-1.3; 3 0.95,-1.3; 4 0.95,1.3; 5 -0.95,1.3
MSOP08 = smd 0.4 x 1.4: 1 -0.975,-2.25; 2 -0.325,-2.25; 3 0.325,-2.25; 4 0.975,-2.25; 5 0.975,2.25; 6 0.324,2.25; 7 -0.325,2.25; 8 -0.975,2.25
PQFN64-1 = smd 0.7 x 0.22: 1 -4.45,3.75; 2 -4.45,3.25; 3 -4.45,2.75; 4 -4.45,2.25; 5 -4.45,1.75; 6 -4.45,1.25; 7 -4.45,0.75; 8 -4.45,0.25; 9 -4.45,-0.25; 10 -4.45,-0.75; 11 -4.45,-1.25; 12 -4.45,-1.75; 13 -4.45,-2.25; 14 -4.45,-2.75; 15 -4.45,-3.25; 16 -4.45,-3.75; 33 4.45,-3.75; 34 4.45,-3.25; 35 4.45,-2.75; 36 4.45,-2.25; 37 4.45,-1.75; 38 4.45,-1.25; 39 4.45,-0.75; 40 4.45,-0.25; 41 4.45,0.25; 42 4.45,0.75; 43 4.45,1.25; 44 4.45,1.75; 45 4.45,2.25; 46 4.45,2.75; 47 4.45,3.25; 48 4.45,3.75 | smd 0.22 x 0.7: 17 -3.75,-4.45; 18 -3.25,-4.45; 19 -2.75,-4.45; 20 -2.25,-4.45; 21 -1.75,-4.45; 22 -1.25,-4.45; 23 -0.75,-4.45; 24 -0.25,-4.45; 25 0.25,-4.45; 26 0.75,-4.45; 27 1.25,-4.45; 28 1.75,-4.45; 29 2.25,-4.45; 30 2.75,-4.45; 31 3.25,-4.45; 32 3.75,-4.45; 49 3.75,4.45; 50 3.25,4.45; 51 2.75,4.45; 52 2.25,4.45; 53 1.75,4.45; 54 1.25,4.45; 55 0.75,4.45; 56 0.25,4.45; 57 -0.25,4.45; 58 -0.75,4.45; 59 -1.25,4.45; 60 -1.75,4.45; 61 -2.25,4.45; 62 -2.75,4.45; 63 -3.25,4.45; 64 -3.75,4.45 | smd 4.7 x 4.7: EXP 0,0
XTAL3215 = smd 1.1 x 1.9: P$1 1.2,0; P$2 -1.2,0

### Placement (x,y rotation side)
C1  24.65,27.43 90 top
C2  21.84,38.61 90 top
C3  34.37,44.84 180 top
C4  34.37,46.79 180 top
C6  11.79,19.49 270 top
C8  14.47,23.51 0 top
C13  18.95,14.72 90 top
C15  20.7,41.19 0 top
C16  17.8,38.89 0 top
C18  12.4,32.39 270 top
C19  21.1,43.79 180 top
C20  21.27,16 180 top
C21  35.66,27.75 90 top
C22  18.87,17.72 90 top
C23  29.41,14.91 180 top
C24  13.6,16.15 270 top
C25  18.54,20.96 270 top
C26  21.97,25.34 180 top
D1  10.1,21.97 180 top
D4  12.7,39.19 90 top
D+  5.08,20.07 0 bottom
D-  5.08,22.1 0 bottom
J1  3.05,21.08 270 top
JP1  46.99,41.15 90 top
JP2  19.76,9.58 270 top
JP12  16.45,36.08 270 top
JP13  19.47,36.08 270 top
JP_AD  39.88,2.54 0 top
JP_IOH  12.95,50.8 0 top
JP_IOL  37.34,50.8 0 top
JP_POWER  19.56,2.54 0 top
L1  5.5,41.09 270 top
L2  20.83,21.46 270 top
LED1  37.34,15.24 180 top
LED2  39.12,16.26 180 top
OP1  25.15,37.08 90 top
R1  8.38,25.15 270 top
R2  37.34,18.29 270 top
R3  29.46,36.07 0 top
R4  8.64,13.12 180 top
R5  39.12,19.56 270 top
R6  39.62,35.81 270 top
R7  40.39,33.27 0 top
R8  28.96,39.37 270 top
R9  23.62,40.39 270 top
R10  39.61,40.46 270 top
R13  16.89,20.57 90 top
R14  21.15,17.72 0 top
R16  21,46.09 180 top
R17  13.45,43.64 180 top
R18  13.5,45.59 0 top
S3  3.81,12.45 0 top
U1  36.38,40.34 180 top
U2  14.48,20.57 0 top
U9  17.2,43.29 180 top
U$1  49.28,13.21 90 top
U$14  29.91,20.7 90 top
X4  21.55,14.15 180 top

### Tracks (layer width: path | path; a pad name or v marks a point on that pad's centre or on a via)
12V  (via drill 0.33, 0.85)
  Top 0.222: R17.2 11.55,43.64 v11.4,43.49
  Top 0.33: v9.91,32.26 11.44,33.79 C18.1
  Top 0.457: JP12.1 15.52,37.19 D4.C
  Bottom 0.35: 14.4,42.29 13.2,43.49 v11.4,43.49
  Bottom 0.457: 14.4,42.29 14.48,42.22 14.48,37.59 15.81,36.26 JP12.1
  pour Top: 10.7,38.49 14.9,38.49 14.9,35.19 14.3,32.99 13.9,32.39 11.5,32.39 9.5,34.99 9.4,36.39 9.4,36.99
!RESET  (via drill 0.39)
  Top 0.254: v23.05,22.92 23.08,22.95 24.28,22.95 24.29,22.94 24.89,22.94 24.9,22.95 U$14.52 | R4.2 7.79,15.37 7.81,15.39 9.63,15.39 9.84,15.18 v10.1,15.18 10.98,15.18 | 11.28,15.3 C24.2
  Top 0.381: R4.2 7.11,12.45 S3.2 | 10.98,15.18 11.11,15.3 11.28,15.3
  Bottom 0.254: v23.05,22.92 22.86,22.92 21.65,21.72 21.65,19.48 19.32,17.14 16.51,17.14 16.19,16.83 16.19,16 15.37,15.18 10.16,15.18 v10.1,15.18
  Bottom 0.33: JP2.10 10.16,12.83 10.16,15.18
+3V3  (via drill 0.35, 0.38, 0.39, 0.4, 0.5)
  Top 0.254: U$14.56 24.06,20.95 22.85,19.74 | C1.1 25.14,26.1 v25.78,26.1 26.16,25.72 U$14.48 | U$14.16 33.66,15.66 | U$14.8 29.66,15.51 C23.1 | U$14.21 35.24,18.95 35.41,18.78
  Top 0.305: C8.1 U2.5 | U2.5 | v14.54,21.97 13.62,21.97 U2.5 | v20.19,19.05 21.86,19.05 22.56,19.74 22.85,19.74 | C22.1 19.72,17.72 R14.1 | U$14.34 33.16,25.79 v34.29,26.92 34.16,26.8 C21.1 | 33.66,15.66 33.66,15.36 v34.04,14.99 | v29.97,13.72 29.97,14.63 C23.1 | 35.41,18.78 35.81,18.38 v35.81,18.29
  Top 0.33: C22.1 18.39,16.87 v17.78,16.26
  Top 0.35: v36.43,44.51 36.35,44.84 C3.1 C4.1
  Top 0.356: U1.3 36.05,43.7 35.22,44.54 C3.1
  Top 0.381: v9.65,11.68 9.49,11.85 R4.1
  Bottom 0.305: 22.92,25.14 22.92,25.15
  pour Bottom: -0.76,54.36 52.07,54.36 52.07,9.14 28.96,9.14 28.96,-0.76 -0.25,-0.76 -0.76,-0.76
AVCC_SET
  Top 0.333: JP13.2 JP12.2
  Top 0.457: 21.91,36.13 OP1.5 | 21.91,36.13 21.6,35.82 21.6,35.49 JP13.2 | 21.91,36.13 21.91,37.69 C2.1
CS_ADC  (via drill 0.35)
  Top 0.254: v34.29,41.15 33.78,41.66 33.78,42.42 34.04,42.67 35.27,42.67 U1.4 | U$14.32 35.63,24.45 38.1,26.92 38.1,33.53 v37.59,34.04
  Bottom 0.254: v34.29,41.15 36.58,38.86 36.58,35.05 v37.59,34.04
CSG0
  Top 0.254: U$14.42 29.16,30.18 35.4,36.42 U1.5
CSG1
  Top 0.254: U$14.41 29.66,29.66 36.07,36.07 36.07,38.12 U1.6
D+  (via drill 0.39, 0.4)
  Top 0.254: 5.71,21.08 6.22,20.57 6.22,20.07 v6.41,20.07 | v26.85,27.61 27.16,27.3 U$14.46
  Top 0.33: J1.3 5.71,21.08
  Bottom 0.254: v26.85,27.61 26.52,27.94 14.22,27.94 6.41,20.13 v6.41,20.07 D+.TP
D-  (via drill 0.39, 0.4)
  Top 0.254: 6.21,21.73 v6.41,21.53 | U$14.45 27.66,27.84 26.8,28.7 v26.73,28.7
  Top 0.33: J1.2 6.21,21.73 v6.41,21.53
  Bottom 0.254: v26.73,28.7 26.48,28.45 14.03,28.45 7.11,21.53 v6.41,21.53 5.84,22.1 D-.TP
EN  (via drill 0.39)
  Top 0.254: U2.3 15.78,19.62 16.13,19.62 | 16.13,19.62 16.23,19.72 R13.1 | 16.13,19.62 16.13,18.8 v16.38,18.54
GND  (via drill 0.39, 0.4)
  Top 0.254: C25.2 18.54,18.9 C22.2 | U$14.7 29.16,15.51 C23.2
  Top 0.33: J1.S2 J1.S6 | J1.S1 J1.S5
  other vias: 9.59,21.91 22.61,21.4 20.13,21.46 25.84,27.18
  pour Top (rank 2): -0.25,53.59 53.85,53.59 53.85,11.68 51.82,9.65 28.7,9.65 28.7,-0.76 -1.27,-0.76 -1.27,53.59
HARVESTER_IN
  Top 0.457: OP1.1 26.62,36.07 R3.1 28.56,37.2 28.96,37.59 R8.2
HIGH_LOAD_V+
  Top 0.356: R3.2 35.65,41.36 R10.1 39.61,42.17 39.25,42.54 U1.1
LED1
  Top 0.254: U$14.23 36.53,19.95 R2.1
LED2
  Top 0.254: U$14.24 39.07,20.45 R5.1
LOW_LOAD_V+
  Top 0.356: R6.1 39.61,36.66 39.61,39.12 | 39.61,39.12 R10.2 42.68,39.56 JP1.2 | U1.8 38.64,38.14 39.61,39.12
N$5
  Top 0.457: OP1.4 23.62,38.15 R9.2 26.07,39.54 26.76,40.22 R8.1
N$7
  Top 0.203: 21.27,15.24 21.27,16.83 22.8,16.83 22.99,16.64
  Top 0.254: U$14.1 24.71,16.25 24.69,16.23 23.39,16.23 22.99,16.64 | 21.27,15.24 21.27,15.07 X4.P$1 20.07,13.87 C13.1
N$8
  Top 0.254: U$14.2 26.66,15.76 26.39,15.49 23.63,15.49 22.75,14.61 X4.P$2 22.75,15.37 C20.1
N$9
  Top 0.33: C15.1 18.32,41.19 U9.8
N$10
  Top 0.254: U$14.55 23.83,21.45 22.7,20.32 20.84,20.32 L2.P$2
N$11
  Top 0.33: R16.2 18.72,46.09 U9.1
N$12
  Top 0.33: C19.1 22,45.99 R16.1
N$13  (via drill 0.33)
  Top 0.333: U9.2 17.52,46.42 v18,46.89 | v15.32,46.64 15.32,46.56 R18.2
  Top 0.45: R18.2 14.35,44.29 R17.1
  Bottom 0.222: v15.32,46.64 15.32,47.44 18,47.44 v18,46.89
N$14
  Top 0.305: R2.2 LED1.A
N$15
  Top 0.305: R5.2 LED2.A
N$17
  cutout Top: 11.8,44.49 13.5,44.49 13.5,46.39 15.3,46.39 15.3,42.79 11.8,42.79
N$18
  cutout Top: 18.9,46.89 22.6,46.89 22.6,42.69 21.1,42.69 21.1,44.89 18.9,44.89
N$19
  cutout Top: 18.7,42.29 18.7,40.09 20.7,40.09 20.7,42.29
N$21
  cutout Top: 3.9,47.89 7.1,47.89 7.1,46.19 10.5,43.19 10.5,38.89 7,35.39 7.1,34.09 4,34.09 3.9,35.89 0.7,39.09 0.8,43.29 3.9,46.19
NV_CLK  (via drill 0.35)
  Top 0.254: v30.3,29.19 30.33,29.21 33.27,29.21 33.5,28.98 33.5,27.02 32.66,26.18 U$14.35
  Bottom 0.254: v30.3,29.19 30.3,30.05 30.99,30.73 30.99,41.66 27.94,44.7 27.94,45.72 26.87,46.79 20.32,46.79 19.2,47.91 | 19.2,47.91 19.15,47.95 | 19.2,47.91 19.15,47.95 | 19.15,47.95 14.72,47.95 13.9,48.77 12.45,48.77 11.68,49.53 JP_IOH.5
NV_CS  (via drill 0.35)
  Top 0.254: U$14.37 31.66,26.32 32.51,27.18 v32.51,27.94
  Bottom 0.254: v32.51,27.94 33.02,28.45 33.02,42.67 27.69,48.01 20.83,48.01 19.3,49.53 JP_IOH.8
NV_READ  (via drill 0.35)
  Top 0.254: U$14.39 30.66,27.23 v30.91,27.48 | JP_IOL.1 28.45,44.81 30.58,42.67 v30.84,42.67
  Bottom 0.254: v30.91,27.48 30.84,27.56 30.84,28.87 31.5,29.53 31.5,42.01 v30.84,42.67
NV_SIMO  (via drill 0.35)
  Top 0.254: v31.98,28.48 32.23,28.48 32.27,28.52 32.75,28.52 33.09,28.18 33.09,27.19 32.16,26.25 U$14.36
  Bottom 0.254: v31.98,28.48 32.61,29.11 32.61,42.42 27.43,47.6 20.66,47.6 19.49,48.77 17.27,48.77 16.76,49.28 JP_IOH.7
NV_SOMI  (via drill 0.35)
  Top 0.254: U$14.38 31.16,26.84 v31.75,27.43
  Bottom 0.254: v31.75,27.43 31.75,27.69 31.24,28.19 31.24,28.7 32,29.46 32,42.42 27.23,47.19 20.49,47.19 19.32,48.36 17.1,48.36 16.7,48.77 14.48,48.77 14.22,49.02 JP_IOH.6
NV_WRITE  (via drill 0.35)
  Top 0.254: U$14.40 30.16,28.04 v30.24,28.12 | v24.64,45.72 21.84,48.51 JP_IOH.9
  Bottom 0.254: v30.24,28.12 30.24,28.43 29.72,28.94 29.72,30.04 30.58,30.9 30.58,40.89 30.48,41 30.48,41.59 26.35,45.72 v24.64,45.72
SW
  Top 0.45: U9.5 12.85,41.04 D4.A
  Top 0.55: D4.A 10.9,41.19 10.2,40.49 10.2,38.79 7.3,35.89 5.55,35.89 L1.P$2
SWDCLK  (via drill 0.39)
  Top 0.254: U$14.57 24.32,20.45 22.86,18.99 v22.86,18.86 22.86,18.58 R14.2
  Bottom 0.33: JP2.4 18.53,8.31 19.4,7.44 20.12,7.44 24.64,11.96 24.64,17.78 23.56,18.86 v22.86,18.86
SWDIO  (via drill 0.39)
  Top 0.254: v23.43,17.65 23.62,17.84 23.62,18.99 24.59,19.95 U$14.58
  Bottom 0.33: JP2.2 23.43,11.98 v23.43,17.65
TDI/RX_DEBUG
  Top 0.305: U$14.14 32.62,16.21 32.62,14.19 24.52,6.1 16.51,6.1 15.95,6.65 JP2.8
TDO/TX_DEBUG
  Top 0.305: 17.78,6.6 24.38,6.6 32.16,14.38 U$14.13
  Top 0.33: JP2.6 17.27,8.25 17.27,7.11 17.78,6.6
VBUS  (via drill 0.33, 0.38, 1.1)
  Top 0.305: 7.05,22.38 7.33,22.38 7.74,21.97 D1.A 8.38,22.11 R1.2 | v8.2,46.89 8.2,47.06 8.64,47.5
  Top 0.33: U9.3 16.88,45.72 16.88,46.84 | 16.88,46.84 16.88,46.87 | v16.85,46.82 16.88,46.84 | U9.6 16.88,39.59 | 16.88,39.59 16.88,38.92 C16.1 | v16,39.39 16.68,39.39 16.88,39.59 | J1.1 7.05,22.38
  Top 0.333: C16.1 17.1,38.69 17.1,38.09 18.1,37.09
  Top 0.381: 6.86,28.45 v8.13,29.72
  Top 0.44: 5.88,46.62 L1.P$1
  Top 0.457: R1.2 7.45,24.3 6.86,24.89 6.86,28.45 1.27,34.04 1.27,44.7 3.18,46.62 5.88,46.62 | 18.1,37.09 18.63,37.09 JP13.1 | 8.64,47.5 16.88,47.5 16.88,46.87
  Top 1: v8.2,46.89 6.15,46.89 5.88,46.62
  Bottom 0.381: v8.13,29.72 9.91,29.72 11.94,31.75 21.34,31.75 22.35,32.77 22.35,35.31 21.34,36.32 21.27,36.26 JP13.1
VDAC  (via drill 0.36)
  Top 0.305: U$14.3 27.16,14.97 v26.67,14.48 | v27.43,39.12 26.92,39.12 26.56,38.75 OP1.3
  Bottom 0.305: v26.67,14.48 26.67,23.62 28.7,25.65 28.7,37.85 v27.43,39.12
VDDCORE1
  Top 0.254: 22.38,22.19 23.48,22.19 23.74,22.45 U$14.53 | L2.P$1 20.81,22.61 20,22.61 19.3,21.91 C25.1 | C26.1 21.84,24.36
  Top 0.33: 21.84,24.36 20.83,23.34 L2.P$1 21.99,22.59 22.38,22.19
VHI
  Top 0.254: U2.1 13.53,20.13 | 13.53,20.13 13.97,20.57 15.81,20.57 16.66,21.42 R13.2 | 13.53,20.13 12.1,20.13 C6.1 11.95,20.6 D1.C
VS_ADC
  Top 0.254: U$14.31 36.14,23.95 39.54,27.34 39.54,28.7 R7.1 39.62,33.36 R6.2

### Text on the board
tPlace: Ext / Harv | L+ | 12V | 12V | 5V | Extended Ekho Shield | RST
bPlace: Ekho Shield Rev A. / for CircuitPython / TU Delft / Northwestern U / Design: Josiah Hester
214bmp: D:/SmartProjects/Snc/a4_bn_logo2.bmp